# Altium project PMSM_Fortior.PrjPcb
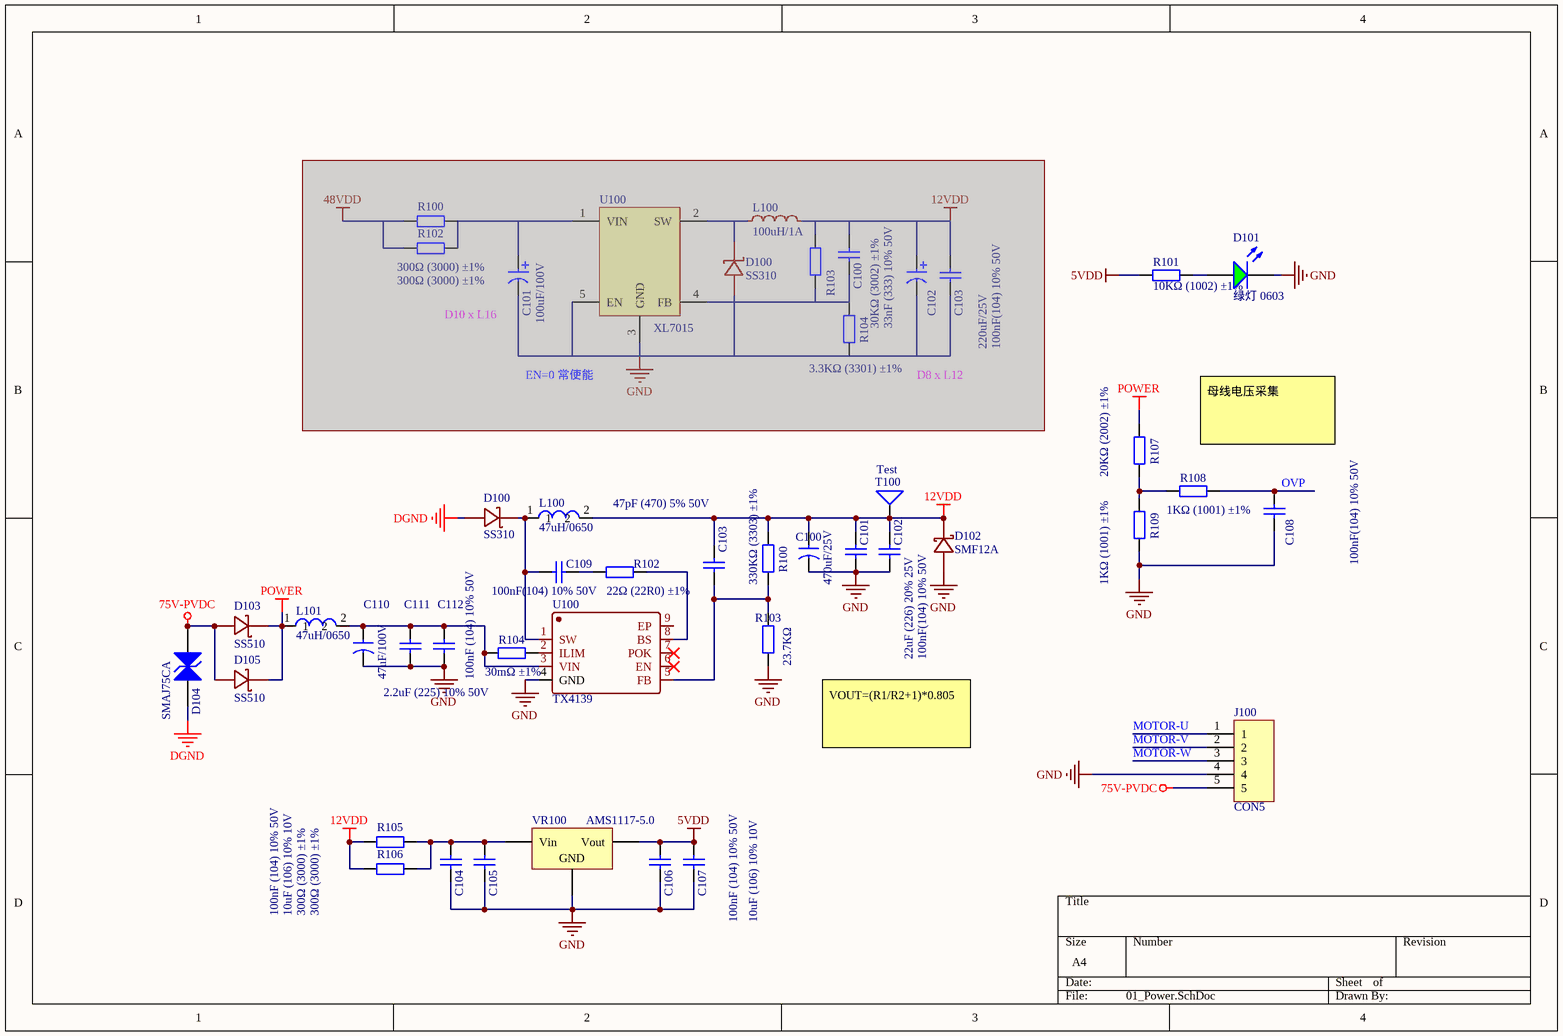
[diagram p0: 01_Power.SchDoc]
4 sheets, 140 parts. Net scope: global (net labels, ports and power ports of the same name join across sheets).
Sheets:
  01_Power.SchDoc
  02_MCU.SchDoc
  03_Mos.SchDoc
  04_Sensor.SchDoc

## Sheet 01_Power.SchDoc
size A4

### Parts
(Parts that share a designator on the sheet are numbered #1, #2 ... from top to bottom, then left to right.)
C100#1  33nF (333) 10% 50V  [0603_C]  (masked out: inside a compile mask, not in the netlist)
C100#2  470uF/25V  [47UF/100V]
C101#1  100uF/100V  [CAP_D10_L16]  (masked out: inside a compile mask, not in the netlist)
C101#2  22uF (226) 20% 25V  [0805_C]
C102#1  220uF/25V  [CAP_D8_L12]  (masked out: inside a compile mask, not in the netlist)
C102#2  100nF(104) 10% 50V  [0805_C]
C103#1  100nF(104) 10% 50V  [0805_C]  (masked out: inside a compile mask, not in the netlist)
C103#2  47pF (470) 5% 50V  [0805_C]
C104  100nF (104) 10% 50V  [0603_C]
C105  10uF (106) 10% 10V  [0603_C]
C106  100nF (104) 10% 50V  [0603_C]
C107  10uF (106) 10% 10V  [0603_C]
C108  100nF(104) 10% 50V  [0805_C]
C109  100nF(104) 10% 50V  [0805_C]
C110  47uF/100V  [47UF/100V]
C111  2.2uF (225) 10% 50V  [1206_C]
C112  100nF (104) 10% 50V  [1206_C]
D100#1  SS310  [SS310]  (masked out: inside a compile mask, not in the netlist)
D100#2  SS310  [SS310]
D101  绿灯 0603  [0603_LED_S1]
D102  SMF12A  [SMF12A - duplicate]
D103  SS510  [SS510]
D104  SMAJ75CA  [SMB(DO-214AA)_S1]
D105  SS510  [SS510]
J100  CON5  [7.62-5P 端子]
L100#1  100uH/1A  [L_D9.5_L12]  (masked out: inside a compile mask, not in the netlist)
L100#2  47uH/0650  [0650_47uH]
L101  47uH/0650  [0650_47uH]
R100#1  300Ω (3000) ±1%  [1206_R]  (masked out: inside a compile mask, not in the netlist)
R100#2  330KΩ (3303) ±1%  [0805_R]
R101  10KΩ (1002) ±1%  [0603_R]
R102#1  300Ω (3000) ±1%  [1206_R]  (masked out: inside a compile mask, not in the netlist)
R102#2  22Ω (22R0) ±1%  [0805_R]
R103#1  30KΩ (3002) ±1%  [0603_R]  (masked out: inside a compile mask, not in the netlist)
R103#2  23.7KΩ  [0805_R]
R104#1  3.3KΩ (3301) ±1%  [0603_R]  (masked out: inside a compile mask, not in the netlist)
R104#2  30mΩ ±1%  [LC-0603_R]
R105  300Ω (3000) ±1%  [1206_R]
R106  300Ω (3000) ±1%  [1206_R]
R107  20KΩ (2002) ±1%  [0805_R]
R108  1KΩ (1001) ±1%  [0805_R]
R109  1KΩ (1001) ±1%  [0805_R]
T100  Test  [Testpoint]
U100#1  XL7015  [XL7015]  (masked out: inside a compile mask, not in the netlist)
U100#2  TX4139  [ESOP8]
VR100  AMS1117-5.0  [SOT-223]

### Nets
5VDD: C106.2 C107.2 R101.2 VR100.2(Vout)
12VDD: C100#2.1 C101#2.2 C102#2.2 C103#2.2 D102.1(K) L100#2.2 R100#2.2 R105.1 R106.1 T100.1
75V-PVDC: D103.2 D104.1(A) D105.2 J100.5
DGND: D100#2.2(A) D104.2(K)
GND: C100#2.2 C101#2.1 C102#2.1 C104.1 C105.1 C106.1 C107.1 C108.1 C110.2 C111.1 C112.1 D101.K D102.2(A) J100.4 R103#2.1 R109.1 U100#2.4(GND) VR100.1(GND)
POWER: D103.1 D105.1 L101.1 R107.2
MOTOR-U: J100.1
MOTOR-V: J100.2
MOTOR-W: J100.3
OVP: C108.2 R108.1
NetC103#2_1: C103#2.1 R100#2.1 R103#2.2 U100#2.5(FB)
NetC104_2: C104.2 C105.2 R105.2 R106.2 VR100.3(Vin)
NetC109_1: C109.1 D100#2.1(K) L100#2.1 U100#2.1(SW)
NetC109_2: C109.2 R102#2.1
NetC110_1: C110.1 C111.2 C112.2 L101.2 R104#2.2 U100#2.3(VIN)
NetD101_A: D101.A R101.1
NetR102#2_2: R102#2.2 U100#2.8(BS)
NetR104#2_1: R104#2.1 U100#2.2(ILIM)
NetR107_1: R107.1 R108.2 R109.2

Not connected (* = marked no-connect by the designer): U100#2 6(EN)* 7(POK)* 9(EP)

### Notes on the sheet
- (near C101#1) D10 x L16
- EN=0 常使能
- D8 x L12
- 母线电压采集
- VOUT=(R1/R2+1)*0.805

### Library data of the parts
C100#1 = 0603 33nF (333) 10% 50V: 贴片电容; ComponentLink1Description: 供应商链接; ComponentLink1URL: http://www.szlcsc.com/product/details_21829.html; Package: 0603; Supplier: LC; SuppliersPartNumber: C21117
C100#2 C110 = CapSMT220u_16V
C101#1 C102#1 = CAP2: 电解电容
C101#2 = 0805 22uF (226) 20% 25V: 贴片电容; ComponentLink1Description: 供应商链接; ComponentLink1URL: http://www.szlcsc.com/product/details_46786.html; Package: 0805; Supplier: LC; SuppliersPartNumber: C45783
C102#2 C103#1 C108 C109 = 0805 100nF(104) 10% 50V: 贴片电容; ComponentLink1Description: 供应商链接; ComponentLink1URL: http://www.szlcsc.com/product/details_50686.html; Package: 0805; Supplier: LC; SuppliersPartNumber: C49678
C103#2 = 0805 47pF (470) 5% 50V: 贴片电容; ComponentLink1Description: 供应商链接; ComponentLink1URL: http://www.szlcsc.com/product/details_15529.html; Package: 0805; Supplier: LC; SuppliersPartNumber: C14857
C104 C106 = 0603 100nF (104) 10% 50V: 贴片电容; ComponentLink1Description: 供应商链接; ComponentLink1URL: http://www.szlcsc.com/product/details_15331.html; Package: 0603; Supplier: LC; SuppliersPartNumber: C14663
C105 C107 = 0603 10uF (106) 10% 10V: 贴片电容; ComponentLink1Description: 供应商链接; ComponentLink1URL: http://www.szlcsc.com/product/details_20411.html; Package: 0603; Supplier: LC; SuppliersPartNumber: C19702
C111 = 1206 2.2uF (225) 10% 50V: 贴片电容; ComponentLink1Description: 供应商链接; ComponentLink1URL: http://www.szlcsc.com/product/details_13292.html; Package: 1206; Supplier: LC; SuppliersPartNumber: C12656
C112 = 1206 100nF (104) 10% 50V: 贴片电容; ComponentLink1Description: 供应商链接; ComponentLink1URL: http://www.szlcsc.com/product/details_25237.html; Package: 1206; Supplier: LC; SuppliersPartNumber: C24497
D101 = 0603 绿灯: 发光二极管; ComponentLink1Description: 供应商链接; ComponentLink1URL: http://www.szlcsc.com/product/details_73152.html; Package: 0603; Supplier: LC; SuppliersPartNumber: C72043
D104 = SMB/DO-214AA P6SMB6.8CA: TVS; ComponentLink1Description: 供应商链接; ComponentLink1URL: http://www.szlcsc.com/product/details_79530.html; Package: SMB/DO-214AA; Supplier: LC; SuppliersPartNumber: C78395
L100#1 = L
L100#2 L101 = Inductor
R100#1 R102#1 R105 R106 = 1206 300Ω (3000) 1%: 贴片电阻; ComponentLink1Description: 供应商链接; ComponentLink1URL: http://www.szlcsc.com/product/details_18575.html; Package: 1206; Supplier: LC; SuppliersPartNumber: C17887
R100#2 = 0805 330KΩ (3303) 1%: 贴片电阻; ComponentLink1Description: 供应商链接; ComponentLink1URL: http://www.szlcsc.com/product/details_18317.html; Package: 0805; Supplier: LC; SuppliersPartNumber: C17629
R101 = 0603 10KΩ (1002) 1%: 贴片电阻; ComponentLink1Description: 供应商链接; ComponentLink1URL: http://www.szlcsc.com/product/details_26547.html; Package: 0603; Supplier: LC; SuppliersPartNumber: C25804
R102#2 R103#2 = 0805 22Ω (22R0) 1%: 贴片电阻; ComponentLink1Description: 供应商链接; ComponentLink1URL: http://www.szlcsc.com/product/details_18249.html; Package: 0805; Supplier: LC; SuppliersPartNumber: C17561
R103#1 = 0603 30KΩ (3002) 1%: 贴片电阻; ComponentLink1Description: 供应商链接; ComponentLink1URL: http://www.szlcsc.com/product/details_23711.html; Package: 0603; Supplier: LC; SuppliersPartNumber: C22984
R104#1 = 0603 3.3KΩ (3301) 1%: 贴片电阻; ComponentLink1Description: 供应商链接; ComponentLink1URL: http://www.szlcsc.com/product/details_23705.html; Package: 0603; Supplier: LC; SuppliersPartNumber: C22978
R104#2 = 0603 100KΩ (1003) 1%: 贴片电阻; ComponentLink1Description: 供应商链接; ComponentLink1URL: http://www.szlcsc.com/product/details_26546.html; Package: 0603; Supplier: LC; SuppliersPartNumber: C25803
R107 = 0805 20KΩ (2002) 1%: 贴片电阻; ComponentLink1Description: 供应商链接; ComponentLink1URL: http://www.szlcsc.com/product/details_4735.html; Package: 0805; Supplier: LC; SuppliersPartNumber: C4328
R108 R109 = 0805 1KΩ (1001) 1%: 贴片电阻; ComponentLink1Description: 供应商链接; ComponentLink1URL: http://www.szlcsc.com/product/details_18201.html; Package: 0805; Supplier: LC; SuppliersPartNumber: C17513
T100 = TestPad
VR100 = SOT-223 AMS1117-5.0: 低压差线性稳压(LDO); ComponentLink1Description: 供应商链接; ComponentLink1URL: http://www.szlcsc.com/product/details_6653.html; Package: SOT-223; Supplier: LC; SuppliersPartNumber: C6187

## Sheet 02_MCU.SchDoc
size A4
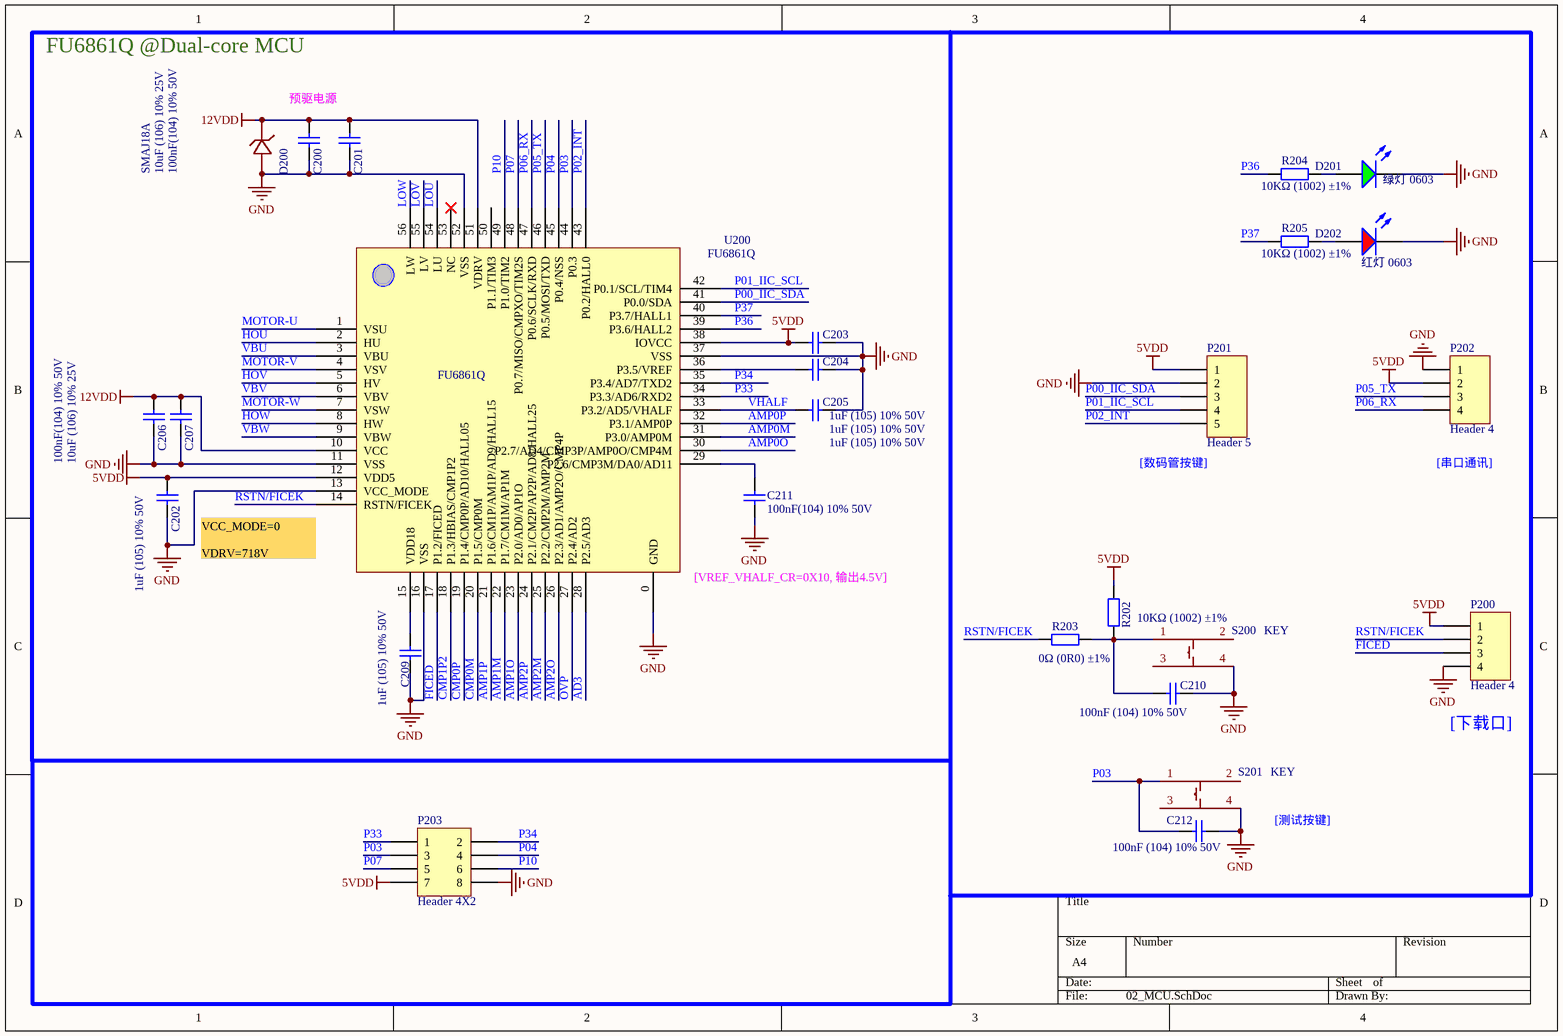
[diagram p1: 02_MCU.SchDoc]

### Parts
C200  10uF (106) 10% 25V  [0805_C]
C201  100nF(104) 10% 50V  [0805_C]
C202  1uF (105) 10% 50V  [0805_C]
C203  1uF (105) 10% 50V  [0805_C]
C204  1uF (105) 10% 50V  [0805_C]
C205  1uF (105) 10% 50V  [0805_C]
C206  10uF (106) 10% 25V  [0805_C]
C207  100nF(104) 10% 50V  [0805_C]
C209  1uF (105) 10% 50V  [0805_C]
C210  100nF (104) 10% 50V  [0603_C]
C211  100nF(104) 10% 50V  [0805_C]
C212  100nF (104) 10% 50V  [0603_C]
D200  SMAJ18A  [SMAJ18A]
D201  绿灯 0603  [0603_LED_S1]
D202  红灯 0603  [0603_LED_S1]
P200  Header 4  [HDR1X4]
P201  Header 5  [HDR1X5]
P202  Header 4  [HDR1X4]
P203  Header 4X2  [HDR2X4]
R202  10KΩ (1002) ±1%  [0603_R]
R203  0Ω (0R0) ±1%  [0603_R]
R204  10KΩ (1002) ±1%  [0805_R]
R205  10KΩ (1002) ±1%  [0805_R]
S200  KEY  [KEY_WHITE]
S201  KEY  [KEY_WHITE]
U200  FU6861Q  [FU6861Q]

### Nets
5VDD: C202.2 C203.1 P200.1 P201.1 P202.2 P203.7 R202.2 U200.12(VDD5) U200.38(IOVCC)
12VDD: C200.2 C201.2 C206.2 C207.2 D200.1(C) U200.10(VCC) U200.51(VDRV)
GND: C200.1 C201.1 C202.1 C203.2 C204.2 C205.2 C206.1 C207.1 C209.1 C210.2 C211.2 C212.1 D200.2(A) D201.K D202.K P200.4 P201.2 P202.1 P203.8 S200.4 S201.4 U200.0(GND) U200.11(VSS) U200.13(VCC_MODE) U200.16(VSS) U200.37(VSS) U200.52(VSS)
AD3: U200.28(P2.5/AD3)
AMP0M: U200.31(P3.0/AMP0M)
AMP0O: U200.30(P2.7/AD4/CMP3P/AMP0O/CMP4M)
AMP0P: U200.32(P3.1/AMP0P)
AMP1M: U200.22(P1.7/CM1M/AP1M)
AMP1O: U200.23(P2.0/AD0/AP1O)
AMP1P: U200.21(P1.6/CM1P/AM1P/AD9/HALL15)
AMP2M: U200.25(P2.2/CMP2M/AMP2M)
AMP2O: U200.26(P2.3/AD1/AMP2O/CMP4P)
AMP2P: U200.24(P2.1/CM2P/AP2P/AD8/HALL25)
CMP0M: U200.20(P1.5/CMP0M)
CMP0P: U200.19(P1.4/CMP0P/AD10/HALL05)
CMP1P2: U200.18(P1.3/HBIAS/CMP1P2)
FICED: P200.3 U200.17(P1.2/FICED)
HOU: U200.2(HU)
HOV: U200.5(HV)
HOW: U200.8(HW)
LOU: U200.54(LU)
LOV: U200.55(LV)
LOW: U200.56(LW)
MOTOR-U: U200.1(VSU)
MOTOR-V: U200.4(VSV)
MOTOR-W: U200.7(VSW)
OVP: U200.27(P2.4/AD2)
P00_IIC_SDA: P201.3 U200.41(P0.0/SDA)
P01_IIC_SCL: P201.4 U200.42(P0.1/SCL/TIM4)
P02_INT: P201.5 U200.43(P0.2/HALL0)
P03: C212.2 P203.3 S201.1 U200.44(P0.3)
P04: P203.4 U200.45(P0.4/NSS)
P05_TX: P202.3 U200.46(P0.5/MOSI/TXD)
P06_RX: P202.4 U200.47(P0.6/SCLK/RXD)
P07: P203.5 U200.48(P0.7/MISO/CMPXO/TIM2S)
P10: P203.6 U200.49(P1.0/TIM2)
P33: P203.1 U200.34(P3.3/AD6/RXD2)
P34: P203.2 U200.35(P3.4/AD7/TXD2)
P36: R204.1 U200.39(P3.6/HALL2)
P37: R205.1 U200.40(P3.7/HALL1)
RSTN/FICEK: P200.2 R203.1 U200.14(RSTN/FICEK)
VBU: U200.3(VBU)
VBV: U200.6(VBV)
VBW: U200.9(VBW)
VHALF: C205.1 U200.33(P3.2/AD5/VHALF)
NetC204_1: C204.1 U200.36(P3.5/VREF)
NetC209_2: C209.2 U200.15(VDD18)
NetC210_1: C210.1 R202.1 R203.2 S200.1
NetC211_1: C211.1 U200.29(P2.6/CMP3M/DA0/AD11)
NetD201_A: D201.A R204.2
NetD202_A: D202.A R205.2

Not connected (* = marked no-connect by the designer): S200 2 3; S201 2 3; U200 50(P1.1/TIM3) 53(NC)*

### Notes on the sheet
- FU6861Q @Dual-core MCU
- 预驱电源
- (near P201) [数码管按键]
- (near P202) [串口通讯]
- VCC_MODE=0
  VDRV=718V
- (near U200) [VREF_VHALF_CR=0X10, 输出4.5V]
- (near P200) [下载口]
- [测试按键]

### Library data of the parts
C200 C206 = 0805 10uF (106) 10% 25V: 贴片电容; ComponentLink1Description: 供应商链接; ComponentLink1URL: http://www.szlcsc.com/product/details_16532.html; Package: 0805; Supplier: LC; SuppliersPartNumber: C15850
C201 C207 C211 = 0805 100nF(104) 10% 50V: 贴片电容; ComponentLink1Description: 供应商链接; ComponentLink1URL: http://www.szlcsc.com/product/details_50686.html; Package: 0805; Supplier: LC; SuppliersPartNumber: C49678
C202-C205 C209 = 0805 1uF (105) 10% 50V: 贴片电容; ComponentLink1Description: 供应商链接; ComponentLink1URL: http://www.szlcsc.com/product/details_29074.html; Package: 0805; Supplier: LC; SuppliersPartNumber: C28323
C210 C212 = 0603 100nF (104) 10% 50V: 贴片电容; ComponentLink1Description: 供应商链接; ComponentLink1URL: http://www.szlcsc.com/product/details_15331.html; Package: 0603; Supplier: LC; SuppliersPartNumber: C14663
D200 = SMAJ18A: C435545
D201 = 0603 绿灯: 发光二极管; ComponentLink1Description: 供应商链接; ComponentLink1URL: http://www.szlcsc.com/product/details_73152.html; Package: 0603; Supplier: LC; SuppliersPartNumber: C72043
D202 = 0603 红灯: 发光二极管; ComponentLink1Description: 供应商链接; ComponentLink1URL: http://www.szlcsc.com/product/details_2659.html; Package: 0603; Supplier: LC; SuppliersPartNumber: C2286
P200 P202 = Header 4: Header, 4-Pin; LatestRevisionDate: 17-Jul-2002; LatestRevisionNote: Re-released for DXP Platform.; Publisher: Altium Limited
P201 = Header 5: Header, 5-Pin; LatestRevisionDate: 17-Jul-2002; LatestRevisionNote: Re-released for DXP Platform.; Publisher: Altium Limited
P203 = Header 4X2: Header, 4-Pin, Dual row; LatestRevisionDate: 17-Jul-2002; LatestRevisionNote: Re-released for DXP Platform.; Publisher: Altium Limited
R202 = 0603 10KΩ (1002) 1%: 贴片电阻; ComponentLink1Description: 供应商链接; ComponentLink1URL: http://www.szlcsc.com/product/details_26547.html; Package: 0603; Supplier: LC; SuppliersPartNumber: C25804
R203 = 0603 0Ω (0R0) 1%: 贴片电阻; ComponentLink1Description: 供应商链接; ComponentLink1URL: http://www.szlcsc.com/product/details_21903.html; Package: 0603; Supplier: LC; SuppliersPartNumber: C21189
R204 R205 = 0805 10KΩ (1002) 1%: 贴片电阻; ComponentLink1Description: 供应商链接; ComponentLink1URL: http://www.szlcsc.com/product/details_18102.html; Package: 0805; Supplier: LC; SuppliersPartNumber: C17414
S200 S201 = KEY: 白色方块

## Sheet 03_Mos.SchDoc
size A4
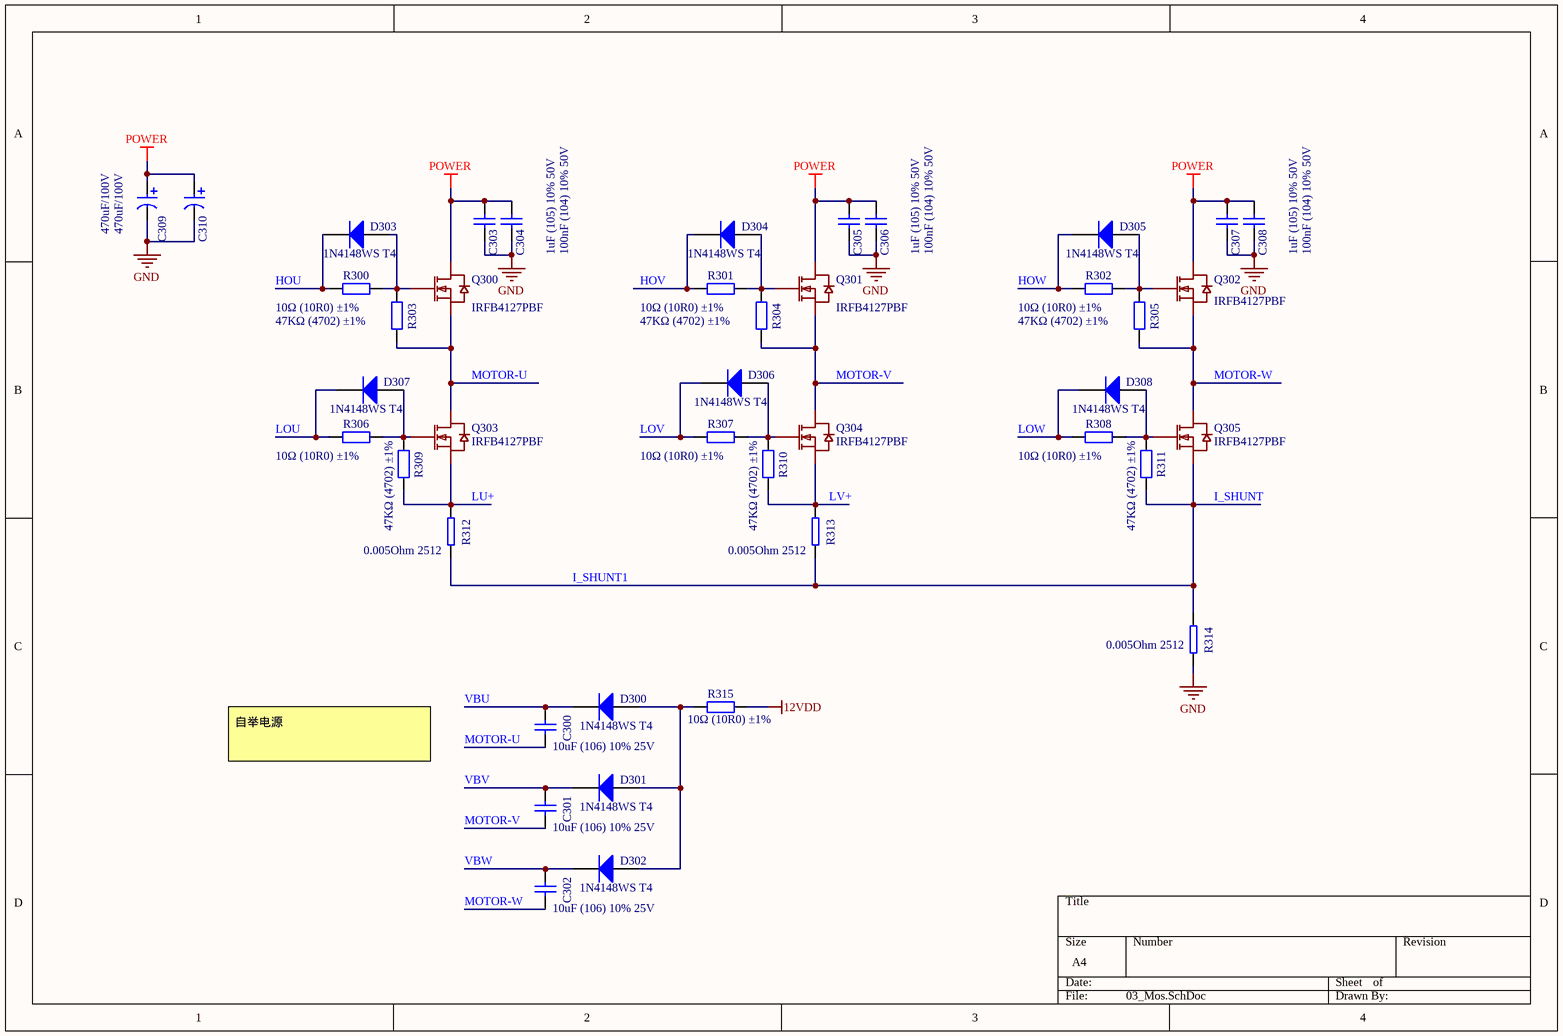
[diagram p2: 03_Mos.SchDoc]

### Parts
C300  10uF (106) 10% 25V  [0805_C]
C301  10uF (106) 10% 25V  [0805_C]
C302  10uF (106) 10% 25V  [0805_C]
C303  100nF (104) 10% 50V  [1206_C]
C304  1uF (105) 10% 50V  [1206_C]
C305  100nF (104) 10% 50V  [1206_C]
C306  1uF (105) 10% 50V  [1206_C]
C307  100nF (104) 10% 50V  [1206_C]
C308  1uF (105) 10% 50V  [1206_C]
C309  470uF/100V  [CAP_D16_L31.5]
C310  470uF/100V  [CAP_D16_L31.5]
D300  1N4148WS T4  [SOD-323]
D301  1N4148WS T4  [SOD-323]
D302  1N4148WS T4  [SOD-323]
D303  1N4148WS T4  [SOD-323]
D304  1N4148WS T4  [SOD-323]
D305  1N4148WS T4  [SOD-323]
D306  1N4148WS T4  [SOD-323]
D307  1N4148WS T4  [SOD-323]
D308  1N4148WS T4  [SOD-323]
Q300  IRFB4127PBF  [IRFB4127]
Q301  IRFB4127PBF  [IRFB4127]
Q302  IRFB4127PBF  [IRFB4127]
Q303  IRFB4127PBF  [IRFB4127]
Q304  IRFB4127PBF  [IRFB4127]
Q305  IRFB4127PBF  [IRFB4127]
R300  10Ω (10R0) ±1%  [0805_R]
R301  10Ω (10R0) ±1%  [0805_R]
R302  10Ω (10R0) ±1%  [0805_R]
R303  47KΩ (4702) ±1%  [0805_R]
R304  47KΩ (4702) ±1%  [0805_R]
R305  47KΩ (4702) ±1%  [0805_R]
R306  10Ω (10R0) ±1%  [0805_R]
R307  10Ω (10R0) ±1%  [0805_R]
R308  10Ω (10R0) ±1%  [0805_R]
R309  47KΩ (4702) ±1%  [0805_R]
R310  47KΩ (4702) ±1%  [0805_R]
R311  47KΩ (4702) ±1%  [0805_R]
R312  0.005Ohm 2512  [R2512]
R313  0.005Ohm 2512  [R2512]
R314  0.005Ohm 2512  [R2512]
R315  10Ω (10R0) ±1%  [0805_R]

### Nets
12VDD: R315.2
GND: C303.1 C304.1 C305.1 C306.1 C307.1 C308.1 C309.2 C310.2 R314.1
POWER: C303.2 C304.2 C305.2 C306.2 C307.2 C308.2 C309.1 C310.1 Q300.2(D) Q301.2(D) Q302.2(D)
HOU: D303.2(K) R300.1
HOV: D304.2(K) R301.1
HOW: D305.2(K) R302.1
I_SHUNT: Q305.3(S) R311.1 R312.1 R313.1 R314.2  [also labelled I_SHUNT1]
LOU: D307.2(K) R306.1
LOV: D306.2(K) R307.1
LOW: D308.2(K) R308.1
LU+: Q303.3(S) R309.1 R312.2
LV+: Q304.3(S) R310.1 R313.2
MOTOR-U: C300.1 Q300.3(S) Q303.2(D) R303.1
MOTOR-V: C301.1 Q301.3(S) Q304.2(D) R304.1
MOTOR-W: C302.1 Q302.3(S) Q305.2(D) R305.1
VBU: C300.2 D300.2(K)
VBV: C301.2 D301.2(K)
VBW: C302.2 D302.2(K)
NetD300_1: D300.1(A) D301.1(A) D302.1(A) R315.1
NetD303_1: D303.1(A) Q300.1(G) R300.2 R303.2
NetD304_1: D304.1(A) Q301.1(G) R301.2 R304.2
NetD305_1: D305.1(A) Q302.1(G) R302.2 R305.2
NetD306_1: D306.1(A) Q304.1(G) R307.2 R310.2
NetD307_1: D307.1(A) Q303.1(G) R306.2 R309.2
NetD308_1: D308.1(A) Q305.1(G) R308.2 R311.2

### Notes on the sheet
- 自举电源

### Library data of the parts
C300-C302 = 0805 10uF (106) 10% 25V: 贴片电容; ComponentLink1Description: 供应商链接; ComponentLink1URL: http://www.szlcsc.com/product/details_16532.html; Package: 0805; Supplier: LC; SuppliersPartNumber: C15850
C303 C305 C307 = 1206 100nF (104) 10% 50V: 贴片电容; ComponentLink1Description: 供应商链接; ComponentLink1URL: http://www.szlcsc.com/product/details_25237.html; Package: 1206; Supplier: LC; SuppliersPartNumber: C24497
C304 C306 C308 = 1206 1uF (105) 10% 50V: 贴片电容; ComponentLink1Description: 供应商链接; ComponentLink1URL: http://www.szlcsc.com/product/details_2200.html; Package: 1206; Supplier: LC; SuppliersPartNumber: C1848
C309 C310 = CAP2: 电解电容
D300-D308 = SOD-323 1N4148WS T4: 二极管; ComponentLink1Description: 供应商链接; ComponentLink1URL: http://www.szlcsc.com/product/details_2485.html; Package: SOD-323; Supplier: LC; SuppliersPartNumber: C2128
R300-R302 R306-R308 R315 = 0805 10Ω (10R0) 1%: 贴片电阻; ComponentLink1Description: 供应商链接; ComponentLink1URL: http://www.szlcsc.com/product/details_18103.html; Package: 0805; Supplier: LC; SuppliersPartNumber: C17415
R303-R305 R309-R311 = 0805 47KΩ (4702) 1%: 贴片电阻; ComponentLink1Description: 供应商链接; ComponentLink1URL: http://www.szlcsc.com/product/details_18401.html; Package: 0805; Supplier: LC; SuppliersPartNumber: C17713
R312-R314 = Res10K

## Sheet 04_Sensor.SchDoc
size A4
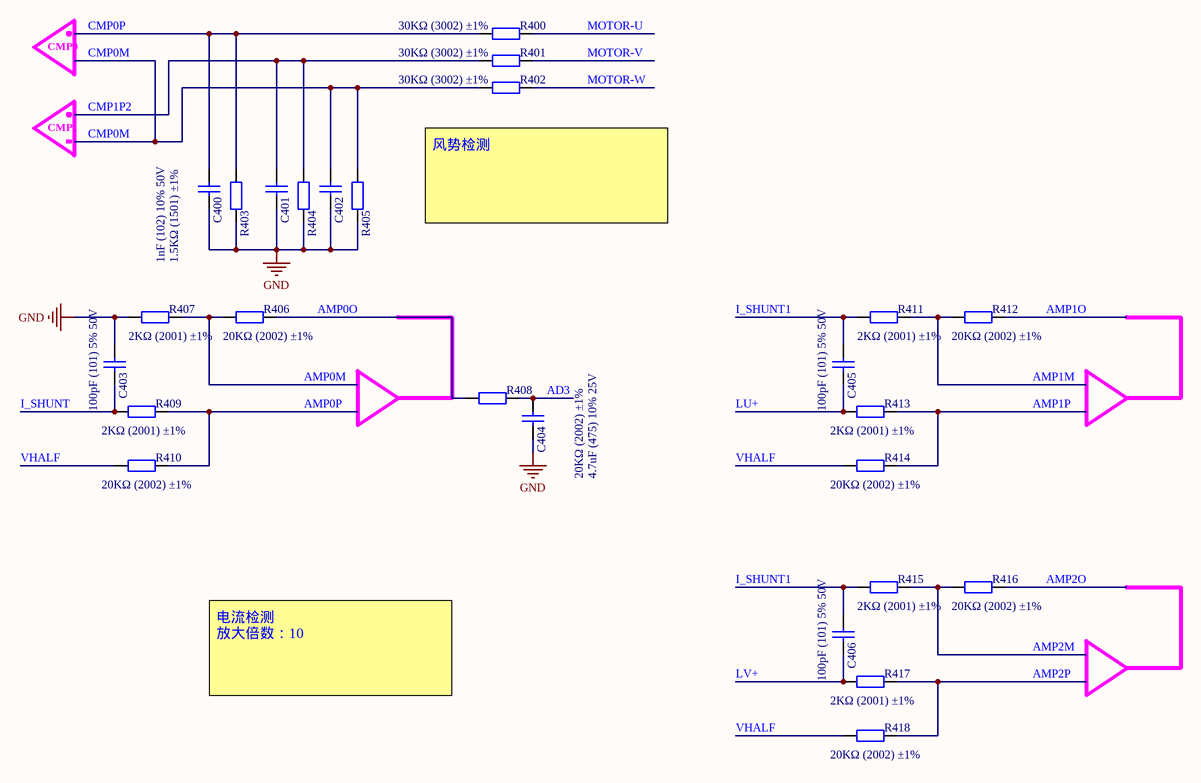
[diagram p3: 04_Sensor.SchDoc]

### Parts
C400  1nF (102) 10% 50V  [0805_C]
C401  1nF (102) 10% 50V  [0805_C]  (value not drawn)
C402  1nF (102) 10% 50V  [0805_C]  (value not drawn)
C403  100pF (101) 5% 50V  [0805_C]
C404  4.7uF (475) 10% 25V  [0805_C]
C405  100pF (101) 5% 50V  [0805_C]
C406  100pF (101) 5% 50V  [0805_C]
R400  30KΩ (3002) ±1%  [0805_R]
R401  30KΩ (3002) ±1%  [0805_R]
R402  30KΩ (3002) ±1%  [0805_R]
R403  1.5KΩ (1501) ±1%  [0805_R]
R404  1.5KΩ (1501) ±1%  [0805_R]  (value not drawn)
R405  1.5KΩ (1501) ±1%  [0805_R]  (value not drawn)
R406  20KΩ (2002) ±1%  [0805_R]
R407  2KΩ (2001) ±1%  [0805_R]
R408  20KΩ (2002) ±1%  [0805_R]
R409  2KΩ (2001) ±1%  [0805_R]
R410  20KΩ (2002) ±1%  [0805_R]
R411  2KΩ (2001) ±1%  [0805_R]
R412  20KΩ (2002) ±1%  [0805_R]
R413  2KΩ (2001) ±1%  [0805_R]
R414  20KΩ (2002) ±1%  [0805_R]
R415  2KΩ (2001) ±1%  [0805_R]
R416  20KΩ (2002) ±1%  [0805_R]
R417  2KΩ (2001) ±1%  [0805_R]
R418  20KΩ (2002) ±1%  [0805_R]

### Nets
GND: C400.1 C401.1 C402.1 C403.2 C404.1 R403.1 R404.1 R405.1 R407.1
AD3: C404.2 R408.2
AMP0M: R406.1 R407.2
AMP0O: R406.2 R408.1
AMP0P: R409.2 R410.2
AMP1M: R411.2 R412.1
AMP1O: R412.2
AMP1P: R413.2 R414.2
AMP2M: R415.2 R416.1
AMP2O: R416.2
AMP2P: R417.2 R418.2
CMP0M: C402.2 R402.1 R405.2
CMP0P: C400.2 R400.1 R403.2
CMP1P2: C401.2 R401.1 R404.2
I_SHUNT: C403.1 C405.2 C406.2 R409.1 R411.1 R415.1  [also labelled I_SHUNT1]
LU+: C405.1 R413.1
LV+: C406.1 R417.1
MOTOR-U: R400.2
MOTOR-V: R401.2
MOTOR-W: R402.2
VHALF: R410.1 R414.1 R418.1

### Notes on the sheet
- CMP0
- CMP1
- (near R402) 风势检测
- 电流检测
  放大倍数：10

### Library data of the parts
C400-C402 = 0805 1nF (102) 10% 50V: 贴片电容; ComponentLink1Description: 供应商链接; ComponentLink1URL: http://www.szlcsc.com/product/details_52223.html; Package: 0805; Supplier: LC; SuppliersPartNumber: C51210
C403 C405 C406 = 0805 100pF (101) 5% 50V: 贴片电容; ComponentLink1Description: 供应商链接; ComponentLink1URL: http://www.szlcsc.com/product/details_2142.html; Package: 0805; Supplier: LC; SuppliersPartNumber: C1790
C404 = 0805 4.7uF (475) 10% 25V: 贴片电容; ComponentLink1Description: 供应商链接; ComponentLink1URL: http://www.szlcsc.com/product/details_2131.html; Package: 0805; Supplier: LC; SuppliersPartNumber: C1779
R400-R402 = 0603 30KΩ (3002) 1%: 贴片电阻; ComponentLink1Description: 供应商链接; ComponentLink1URL: http://www.szlcsc.com/product/details_23711.html; Package: 0603; Supplier: LC; SuppliersPartNumber: C22984
R403-R405 = 0805 1.5KΩ (1501) 1%: 贴片电阻; ComponentLink1Description: 供应商链接; ComponentLink1URL: http://www.szlcsc.com/product/details_4717.html; Package: 0805; Supplier: LC; SuppliersPartNumber: C4310
R406 R408 R410 R412 R414 R416 R418 = 0805 20KΩ (2002) 1%: 贴片电阻; ComponentLink1Description: 供应商链接; ComponentLink1URL: http://www.szlcsc.com/product/details_4735.html; Package: 0805; Supplier: LC; SuppliersPartNumber: C4328
R407 R409 R411 R413 R415 R417 = 0805 2KΩ (2001) 1%: 贴片电阻; ComponentLink1Description: 供应商链接; ComponentLink1URL: http://www.szlcsc.com/product/details_18292.html; Package: 0805; Supplier: LC; SuppliersPartNumber: C17604

## Nets that join several sheets
5VDD: 01_Power (C106.2 C107.2 R101.2 VR100.2), 02_MCU (9 pins)
12VDD: 01_Power (10 pins), 02_MCU (7 pins), 03_Mos (R315.2)
GND: 01_Power (18 pins), 02_MCU (27 pins), 03_Mos (9 pins), 04_Sensor (9 pins)
POWER: 01_Power (D103.1 D105.1 L101.1 R107.2), 03_Mos (11 pins)
AD3: 02_MCU (U200.28), 04_Sensor (C404.2 R408.2)
AMP0M: 02_MCU (U200.31), 04_Sensor (R406.1 R407.2)
AMP0O: 02_MCU (U200.30), 04_Sensor (R406.2 R408.1)
AMP0P: 02_MCU (U200.32), 04_Sensor (R409.2 R410.2)
AMP1M: 02_MCU (U200.22), 04_Sensor (R411.2 R412.1)
AMP1O: 02_MCU (U200.23), 04_Sensor (R412.2)
AMP1P: 02_MCU (U200.21), 04_Sensor (R413.2 R414.2)
AMP2M: 02_MCU (U200.25), 04_Sensor (R415.2 R416.1)
AMP2O: 02_MCU (U200.26), 04_Sensor (R416.2)
AMP2P: 02_MCU (U200.24), 04_Sensor (R417.2 R418.2)
CMP0M: 02_MCU (U200.20), 04_Sensor (C402.2 R402.1 R405.2)
CMP0P: 02_MCU (U200.19), 04_Sensor (C400.2 R400.1 R403.2)
CMP1P2: 02_MCU (U200.18), 04_Sensor (C401.2 R401.1 R404.2)
HOU: 02_MCU (U200.2), 03_Mos (D303.2 R300.1)
HOV: 02_MCU (U200.5), 03_Mos (D304.2 R301.1)
HOW: 02_MCU (U200.8), 03_Mos (D305.2 R302.1)
I_SHUNT: 03_Mos (5 pins), 04_Sensor (6 pins)
LOU: 02_MCU (U200.54), 03_Mos (D307.2 R306.1)
LOV: 02_MCU (U200.55), 03_Mos (D306.2 R307.1)
LOW: 02_MCU (U200.56), 03_Mos (D308.2 R308.1)
LU+: 03_Mos (Q303.3 R309.1 R312.2), 04_Sensor (C405.1 R413.1)
LV+: 03_Mos (Q304.3 R310.1 R313.2), 04_Sensor (C406.1 R417.1)
MOTOR-U: 01_Power (J100.1), 02_MCU (U200.1), 03_Mos (C300.1 Q300.3 Q303.2 R303.1), 04_Sensor (R400.2)
MOTOR-V: 01_Power (J100.2), 02_MCU (U200.4), 03_Mos (C301.1 Q301.3 Q304.2 R304.1), 04_Sensor (R401.2)
MOTOR-W: 01_Power (J100.3), 02_MCU (U200.7), 03_Mos (C302.1 Q302.3 Q305.2 R305.1), 04_Sensor (R402.2)
OVP: 01_Power (C108.2 R108.1), 02_MCU (U200.27)
VBU: 02_MCU (U200.3), 03_Mos (C300.2 D300.2)
VBV: 02_MCU (U200.6), 03_Mos (C301.2 D301.2)
VBW: 02_MCU (U200.9), 03_Mos (C302.2 D302.2)
VHALF: 02_MCU (C205.1 U200.33), 04_Sensor (R410.1 R414.1 R418.1)